# Altium schematic sheet Stepper-Drivers.SchDoc: RespiraWorks
size A3; CompanyName: RespiraWorks; DrawnBy: K. Laws; Organization: Altium; DocumentNumber: 8; Revision: A1; SheetNumber: 8; SheetTotal: 8; PageSetup: Record=PageOptions|CenterHorizontal=True|CenterVertical=True|PrintScale=0.67|XCorrection=1.00|YCorrection=1.00|PrintKind=0|BorderSize=5000000|LeftOffset=0|BottomOffset=0|Orientation=2|PaperLength=1000|PaperWidth=1000|Scale=100|PaperSource=276|PrintQuality=-3|MediaType=1|DitherType=10|PrintScaleMode=1|PaperKind=11"x17" 279.4x431.8mm|PaperIndex=3; ProjectName: FALCON 3S
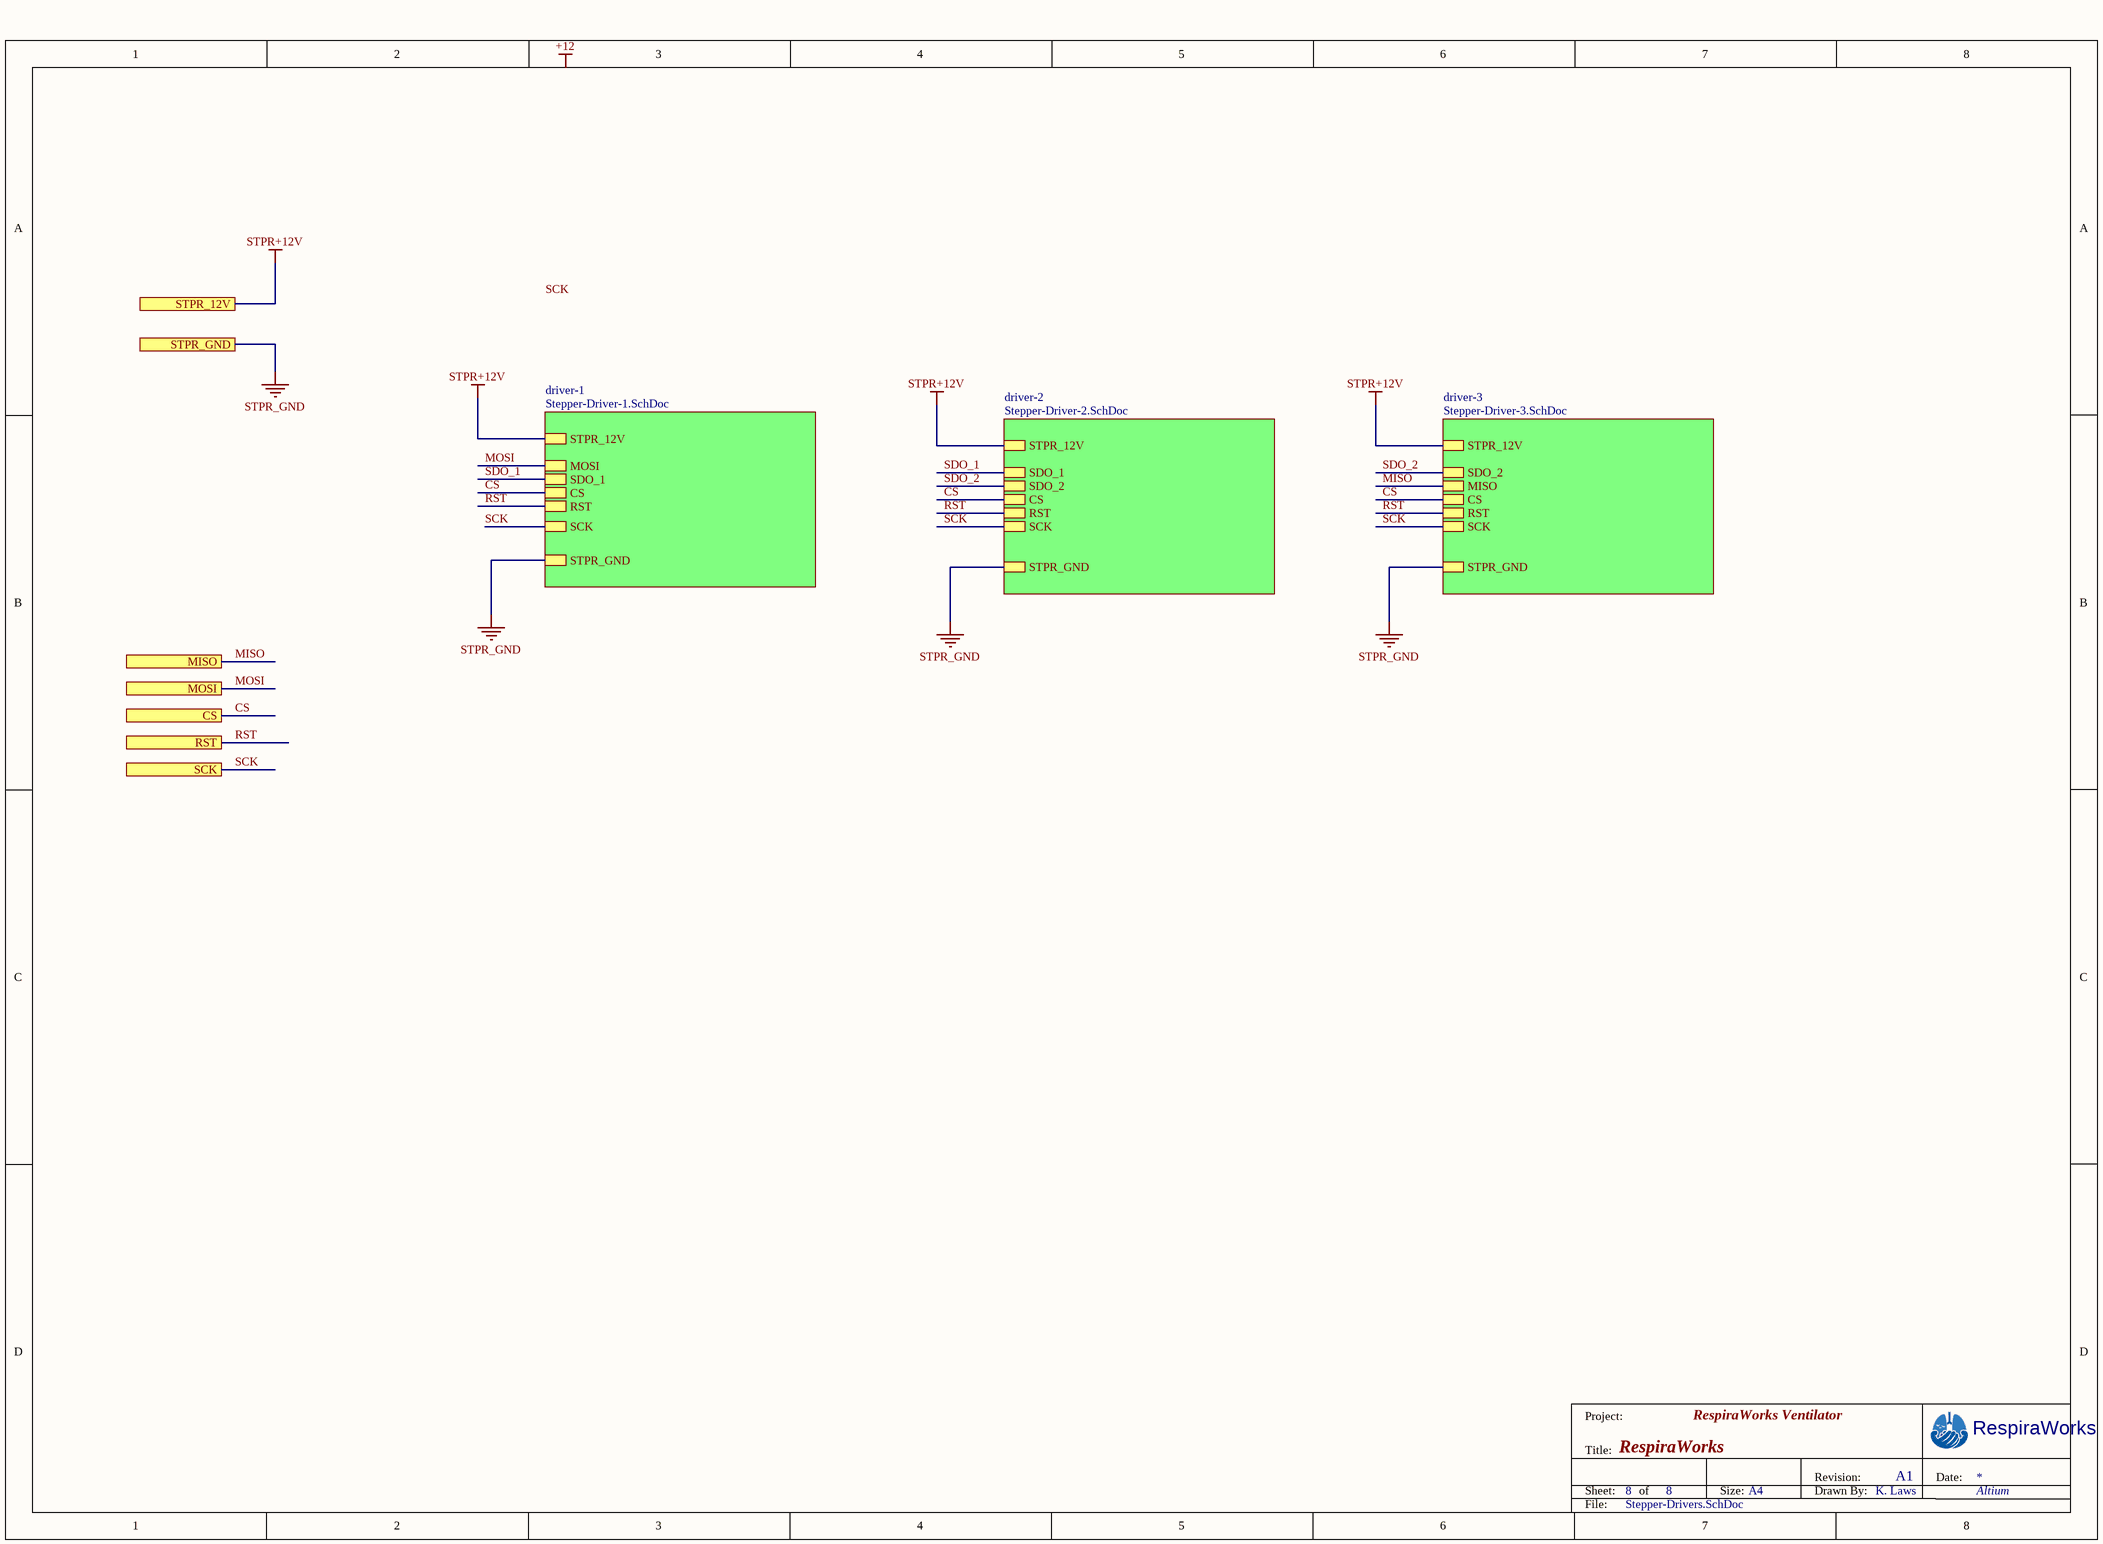
[diagram p0: Stepper-Drivers.SchDoc]

## Sub-sheets
driver-1 = Stepper-Driver-1.SchDoc: STPR_12V, STPR_GND, MOSI, CS, SDO_1, SCK, RST
driver-2 = Stepper-Driver-2.SchDoc: STPR_12V, STPR_GND, CS, RST, SDO_1, SDO_2, SCK
driver-3 = Stepper-Driver-3.SchDoc: STPR_12V, STPR_GND, CS, RST, SDO_2, SCK, MISO

## Ports
CS, MISO, MOSI, RST, SCK, STPR_12V, STPR_GND

## Nets
STPR+12V: port STPR_12V, sheet driver-1/STPR_12V, sheet driver-2/STPR_12V, sheet driver-3/STPR_12V
STPR_GND: port STPR_GND, sheet driver-1/STPR_GND, sheet driver-2/STPR_GND, sheet driver-3/STPR_GND
CS: port CS, sheet driver-1/CS, sheet driver-2/CS, sheet driver-3/CS
MISO: port MISO, sheet driver-3/MISO
MOSI: port MOSI, sheet driver-1/MOSI
RST: port RST, sheet driver-1/RST, sheet driver-2/RST, sheet driver-3/RST
SCK: port SCK, sheet driver-1/SCK, sheet driver-2/SCK, sheet driver-3/SCK
SDO_1: sheet driver-1/SDO_1, sheet driver-2/SDO_1
SDO_2: sheet driver-2/SDO_2, sheet driver-3/SDO_2

## Notes on the sheet
- Project:
- RespiraWorks Ventilator
- Title:
- Sheet:
- of
- Size:
- A4
- Drawn By:
- Revision:
- Date:
- File:
- Labels drawn without touching a wire or pin: +12, SCK